# Altium schematic sheet BrainArea.SchDoc
size A4
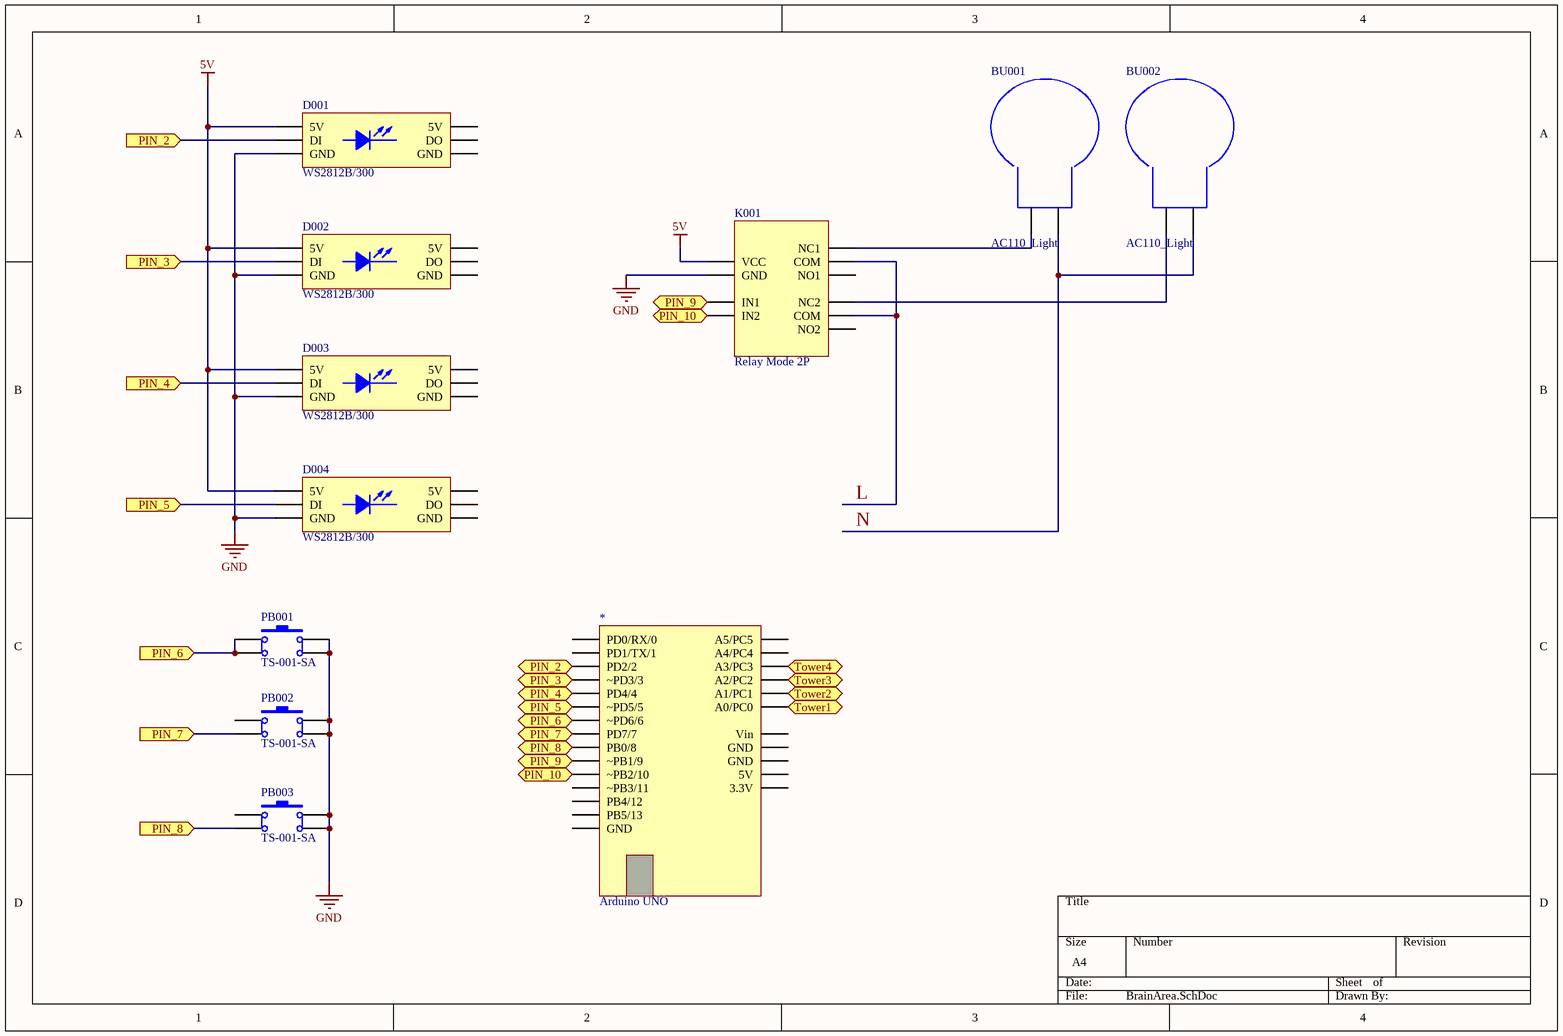
[diagram p0: BrainArea.SchDoc]

## Parts
*  Arduino UNO
BU001  AC110_Light
BU002  AC110_Light
D001  WS2812B/300
D002  WS2812B/300
D003  WS2812B/300
D004  WS2812B/300
K001  Relay Mode 2P
PB001  TS-001-SA
PB002  TS-001-SA
PB003  TS-001-SA

## Ports
PIN_2 (in), PIN_2 (out), PIN_3 (in), PIN_3 (out), PIN_4 (in), PIN_4 (out), PIN_5 (in), PIN_5 (out), PIN_6 (in), PIN_7 (in), PIN_8 (in), PIN_9 (in), PIN_9 (out), PIN_10 (in), PIN_10 (out), Tower1 (out), Tower2 (out), Tower3 (out), Tower4 (in)

## Nets
5V: D001.1(5V) D002.1(5V) D003.1(5V) D004.1(5V) K001.1(VCC)
GND: D001.3(GND) D002.3(GND) D003.3(GND) D004.3(GND) K001.2(GND) PB001.2 PB001.4 PB002.2 PB002.4 PB003.2 PB003.4
L: K001.5(COM) K001.8(COM)
N: BU001.2 BU002.2
PIN_2: *.28(PD2/2) D001.2(DI) ; port PIN_2
PIN_3: *.29(~PD3/3) D002.2(DI) ; port PIN_3
PIN_4: *.30(PD4/4) D003.2(DI) ; port PIN_4
PIN_5: *.31(~PD5/5) D004.2(DI) ; port PIN_5
PIN_6: *.32(~PD6/6) PB001.1 PB001.3 ; port PIN_6
PIN_7: *.33(PD7/7) PB002.3 ; port PIN_7
PIN_8: *.34(PB0/8) PB003.3 ; port PIN_8
PIN_9: *.35(~PB1/9) K001.3(IN1) ; port PIN_9
PIN_10: *.36(~PB2/10) K001.4(IN2) ; port PIN_10
Tower1: *.46(A0/PC0) ; port Tower1
Tower2: *.45(A1/PC1) ; port Tower2
Tower3: *.44(A2/PC2) ; port Tower3
Tower4: *.43(A3/PC3) ; port Tower4
NetBU001_1: BU001.1 K001.6(NC1)
NetBU002_1: BU002.1 K001.9(NC2)

Not connected (* = marked no-connect by the designer): * 26(PD0/RX/0) 27(PD1/TX/1) 37(~PB3/11) 38(PB4/12) 39(PB5/13) 40(GND) 41(A5/PC5) 42(A4/PC4) 47(Vin) 48(GND) 49(GND) 50(5V) 51(3.3V); D001 4(5V) 5(DO) 6(GND); D002 4(5V) 5(DO) 6(GND); D003 4(5V) 5(DO) 6(GND); D004 4(5V) 5(DO) 6(GND); K001 7(NO1) 10(NO2); PB002 1; PB003 1

## Library data of the parts
D001 D002 D003 D004 = WS2812B: LED strip; Voltage: 5V; Number: 300
K001 = Relay Mode 2P: Input Voltage: DC5V; Controll Voltage: AC110; Chanel: 2
PB001 PB002 PB003 = SW-PB: Push Buttom